# Altium project ESP32_RELAY.PrjPcb
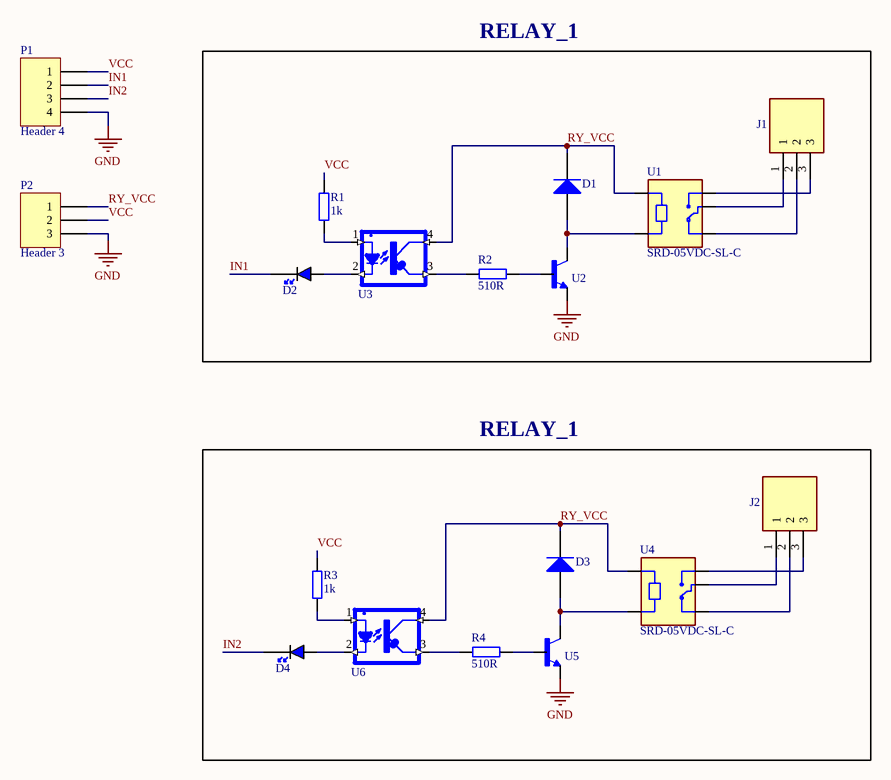
[diagram p0: esp-relay.SchDoc]
1 sheet, 18 parts. Net scope: global (net labels, ports and power ports of the same name join across sheets).
Board file: RELAY_1.PcbDoc

## Sheet esp-relay.SchDoc
size A4; SheetNumber: 1; SheetTotal: 1

### Parts
D1  Diode 1N4003  [DO-41]  (value not drawn)
D2  BLUE  [LED_0603_BLUE]  (value not drawn)
D3  Diode 1N4003  [DO-41]  (value not drawn)
D4  BLUE  [LED_0603_BLUE]  (value not drawn)
J1  Terminal Block Connector  [TB006-508-03BE]  (value not drawn)
J2  Terminal Block Connector  [TB006-508-03BE]  (value not drawn)
P1  Header 4  [HDR1X4]
P2  Header 3  [HDR1X3]
R1  1k  [RES_1206]
R2  510R  [RES_1206]
R3  1k  [RES_1206]
R4  510R  [RES_1206]
U1  SRD-05VDC-SL-C  [RELAY_SRD-03VDC-SL-C]
U2  BCW31 NPN  [SOT23]  (value not drawn)
U3  LTV-817  [DIP-4]  (value not drawn)
U4  SRD-05VDC-SL-C  [RELAY_SRD-03VDC-SL-C]
U5  BCW31 NPN  [SOT23]  (value not drawn)
U6  LTV-817  [DIP-4]  (value not drawn)

### Blocks framed on the sheet
RELAY_1: D1 D2 J1 R1 R2 U1-U3
RELAY_1: D3 D4 J2 R3 R4 U4-U6

### Nets
GND: P1.4 P2.3 U2.E U5.E
IN1: D2.K P1.2
IN2: D4.K P1.3
RY_VCC: D1.2(K) D3.2(K) P2.1 U1.A1 U3.4 U4.A1 U6.4
VCC: P1.1 P2.2 R1.2 R3.2
NetD1_1: D1.1(A) U1.A2 U2.C
NetD2_A: D2.A U3.2
NetD3_1: D3.1(A) U4.A2 U5.C
NetD4_A: D4.A U6.2
NetJ1_1: J1.1 U1.COM
NetJ1_2: J1.2 U1.NC
NetJ1_3: J1.3 U1.NO
NetJ2_1: J2.1 U4.COM
NetJ2_2: J2.2 U4.NC
NetJ2_3: J2.3 U4.NO
NetR1_1: R1.1 U3.1
NetR2_1: R2.1 U2.B
NetR2_2: R2.2 U3.3
NetR3_1: R3.1 U6.1
NetR4_1: R4.1 U5.B
NetR4_2: R4.2 U6.3

### Library data of the parts
D1 D3 = Diode 1N4003: 1 Amp General Purpose Rectifier; Published: 8-Jun-2000; LatestRevisionDate: 17-Jul-2002; LatestRevisionNote: Re-released for DXP Platform.; DatasheetVersion: 1998; PackageVersion: Aug-1999; PackageReference: DO-41; Publisher: Altium Limited; PackageDescription: Diode, Axial; Body 5.2 x 2.7 mm (LxDia. max), Lead Dia. 0.86 mm (max); Code_JEDEC: DO-204-AL; ComponentLink1Description: Manufacturer Link; ComponentLink1URL: http://www.fairchildsemi.com/; ComponentLink2Description: Datasheet; ComponentLink2URL: http://www.fairchildsemi.com/ds/1N%2F1N4001.pdf
D2 D4 = LED_0603_BLUE: LED 0603 BLUE SMD
J1 J2 = TB006-508-03BE: 2~24 Poles, Screw Type, Horizontal, 5.08 Pitch, 26~14 (AWG), Terminal Block Connector
P1 = Header 4: Header, 4-Pin; LatestRevisionDate: 17-Jul-2002; LatestRevisionNote: Re-released for DXP Platform.; Publisher: Altium Limited
P2 = Header 3: Header, 3-Pin; LatestRevisionDate: 17-Jul-2002; LatestRevisionNote: Re-released for DXP Platform.; Publisher: Altium Limited
R1-R4 = RES_1206: Resistor SMD 1206; Manufacturer: *; Manufacturer Part Number: *; Distributor Link: *
U1 U4 = Relay-Songle
U2 U5 = BCW31 NPN: Bipolar (BJT) Transistor NPN General Purpose Amplifier Surface Mount
U3 U6 = LTV-817: Optocouplor